# Altium project PCB_Project.PrjPcb
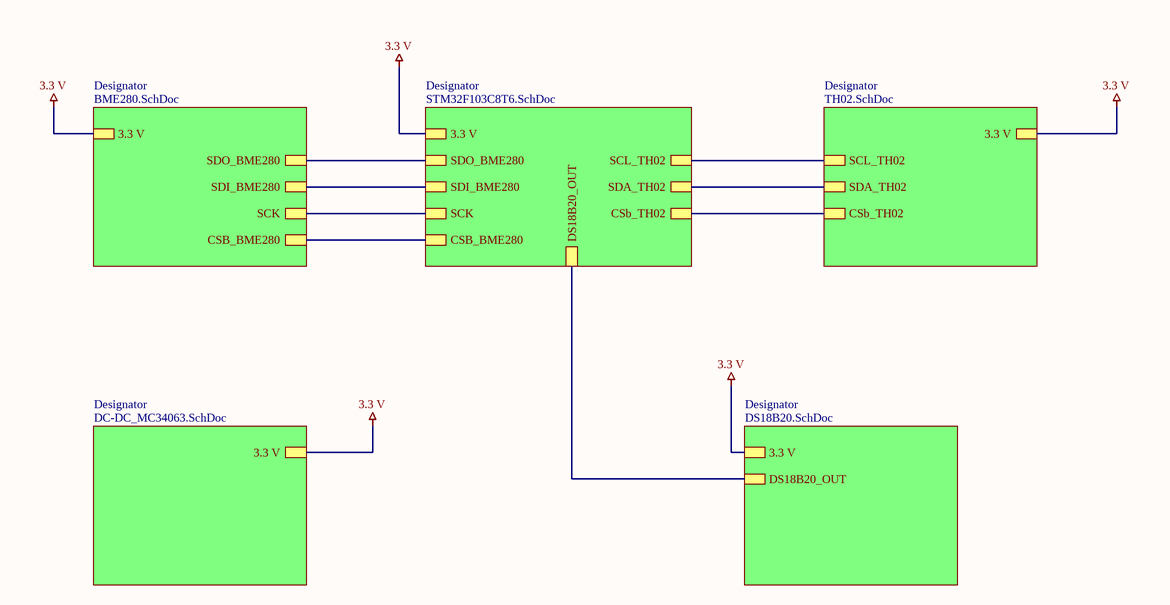
[diagram p0: MainSheet.SchDoc]
6 sheets, 39 parts. Net scope: hierarchical (ports join the sheet entries above them; power ports are global).
Board file: HackatonCircuit.PcbDoc
Sheets:
  MainSheet.SchDoc
    Designator = DC-DC_MC34063.SchDoc
    Designator = STM32F103C8T6.SchDoc
    Designator = DS18B20.SchDoc
    Designator = BME280.SchDoc
    Designator = TH02.SchDoc

## Sheet MainSheet.SchDoc
size A4; SheetNumber: 1; SheetTotal: 6

### Sub-sheets
Designator = DC-DC_MC34063.SchDoc: 3.3 V
Designator = STM32F103C8T6.SchDoc: 3.3 V, SDO_BME280, SDI_BME280, SCK, CSB_BME280, SCL_TH02, SDA_TH02, CSb_TH02, DS18B20_OUT
Designator = DS18B20.SchDoc: 3.3 V, DS18B20_OUT
Designator = BME280.SchDoc: 3.3 V, SDO_BME280, SDI_BME280, SCK, CSB_BME280
Designator = TH02.SchDoc: 3.3 V, SCL_TH02, SDA_TH02, CSb_TH02

### Nets
3.3 V: sheet Designator/3.3 V, sheet Designator/3.3 V, sheet Designator/3.3 V, sheet Designator/3.3 V, sheet Designator/3.3 V
NetIC1_2: sheet Designator/DS18B20_OUT, sheet Designator/DS18B20_OUT
NetIC2_3: sheet Designator/SCL_TH02, sheet Designator/SCL_TH02
NetIC2_4: sheet Designator/SDA_TH02, sheet Designator/SDA_TH02
NetIC2_15: sheet Designator/CSb_TH02, sheet Designator/CSb_TH02
NetIC3_2: sheet Designator/CSB_BME280, sheet Designator/CSB_BME280
NetIC3_3: sheet Designator/SDI_BME280, sheet Designator/SDI_BME280
NetIC3_4: sheet Designator/SCK, sheet Designator/SCK
NetIC3_5: sheet Designator/SDO_BME280, sheet Designator/SDO_BME280

## Sheet DC-DC_MC34063.SchDoc
size A4; SheetNumber: 2; SheetTotal: 6
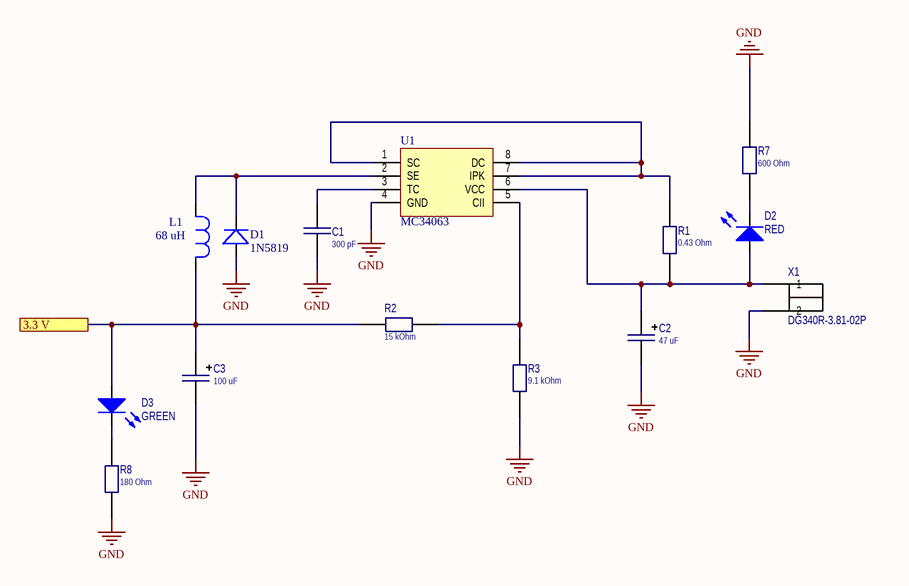
[diagram p1: DC-DC_MC34063.SchDoc]

### Parts
C1  300 pF  [C_0805]
C2  47 uF  [Cap 0810 F]
C3  100 uF  [Cap 0810 F]
D1  1N5819  [DO-41]
D2  RED  [LED_1206]
D3  GREEN  [LED_1206]
L1  68 uH  [L_1210]
R1  0.43 Ohm  [R_0805]
R2  15 kOhm  [R_0805]
R3  9.1 kOhm  [R_0805]
R7  600 Ohm  [R_0805]
R8  180 Ohm  [R_0805]
U1  MC34063  [SO-8]
X1  DG340R-3.81-02P  [340-021-12]

### Ports
3.3 V (see MainSheet[2C], BME280[2B], DS18B20[2C], STM32F103C8T6[1C], TH02[1B])

### Nets
3.3 V: C3.2 D3.1(A) L1.2 R2.1 ; port 3.3 V
GND: C1.1 C2.1 C3.1 D1.1(A) R3.1 R7.2 R8.1 U1.4(GND) X1.2
NetC1_2: C1.2 U1.3(TC)
NetC2_2: C2.2 D2.1(A) R1.1 U1.6(VCC) X1.1
NetD1_2: D1.2(K) L1.1 U1.2(SE)
NetD2_2: D2.2(K) R7.1
NetD3_2: D3.2(K) R8.2
NetR1_2: R1.2 U1.1(SC) U1.7(IPK) U1.8(DC)
NetR2_2: R2.2 R3.2 U1.5(CII)

### Library data of the parts
C1 = C0805: Capacitor; Value: 300 pF
C2 C3 = CAP0810Alu: Capacitor
  C2: Value: 47 uF
  C3: Value: 100 uF
D2 D3 = LED_SMT_1206: Typical INFRARED GaAs LED; Value: *; Color: *
L1 = L1210: Inductor; Part Number: NLCV32T-680K-EF
R1-R3 R7 R8 = R0805: Resistor
  R1: Value: 0.43 Ohm
  R2: Value: 15 kOhm
  R3: Value: 9.1 kOhm
  R7: Value: 600 Ohm
  R8: Value: 180 Ohm
X1 = DG340R-3.81-02P: Connectors; Type: DG340R-3.81-02P

## Sheet STM32F103C8T6.SchDoc
size A4; SheetNumber: 6; SheetTotal: 6
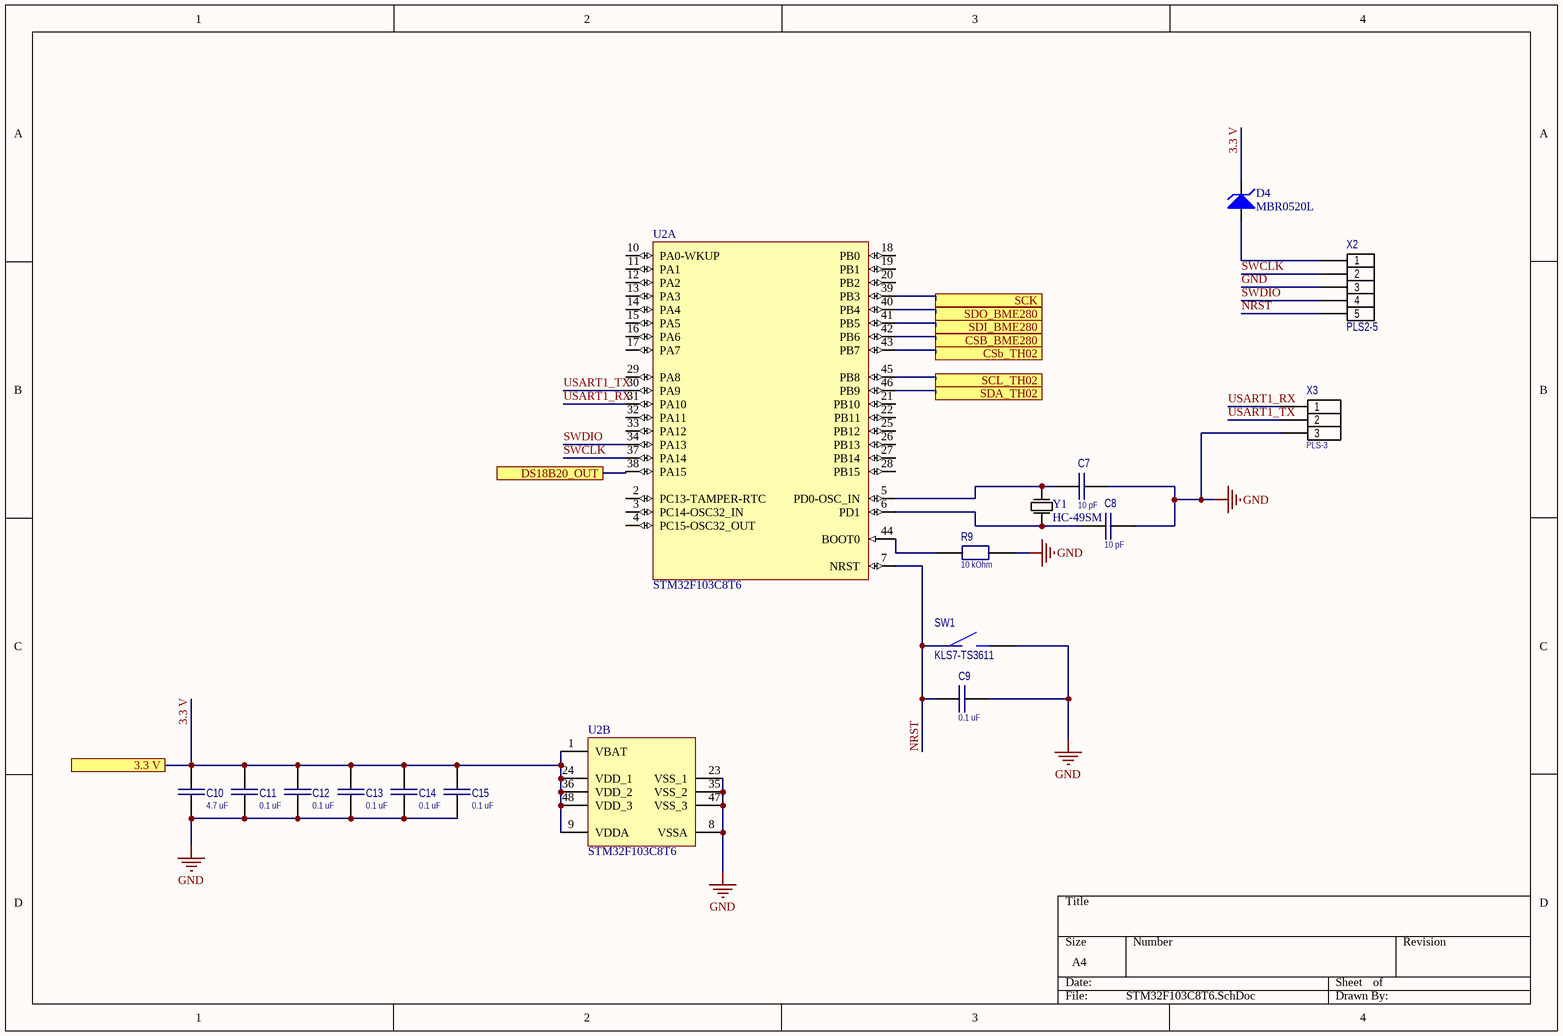
[diagram p2: STM32F103C8T6.SchDoc]

### Parts
C7  10 pF  [C_0805]
C8  10 pF  [C_0805]
C9  0.1 uF  [C_0805]
C10  4.7 uF  [C_0805]
C11  0.1 uF  [C_0805]
C12  0.1 uF  [C_0805]
C13  0.1 uF  [C_0805]
C14  0.1 uF  [C_0805]
C15  0.1 uF  [C_0805]
D4  MBR0520L  [SOD-123]
R9  10 kOhm  [R_0805]
SW1  KLS7-TS3611  [KLS7-TS3611]
U2  STM32F103C8T6  [LQFP48_N]  (parts A,B of 2)
X2  PLS2-5  [PLS-5-2]
X3  PLS-3  [PLS-3-3D]
Y1  HC-49SM  [HC-49SM]

### Ports
3.3 V (see MainSheet[2A], BME280[2B], DC-DC_MC34063[1B], DS18B20[2C], TH02[1B]), CSB_BME280 (see MainSheet[2B], BME280[3B]), CSb_TH02 (see MainSheet[3B], TH02[1C]), DS18B20_OUT (see MainSheet[3B], DS18B20[1B]), SCK (see MainSheet[2B], BME280[3B]), SCL_TH02 (see MainSheet[3B], TH02[1B]), SDA_TH02 (see MainSheet[3B], TH02[1B]), SDI_BME280 (see MainSheet[2B], BME280[3B]), SDO_BME280 (see MainSheet[2B], BME280[1B])

### Nets
3.3 V: C10.2 C11.2 C12.2 C13.2 C14.2 C15.2 D4.2(K) U2.1(VBAT) U2.9(VDDA) U2.24(VDD_1) U2.36(VDD_2) U2.48(VDD_3) ; port 3.3 V
GND: C7.1 C8.1 C9.1 C10.1 C11.1 C12.1 C13.1 C14.1 C15.1 R9.1 SW1.2 U2.8(VSSA) U2.23(VSS_1) U2.35(VSS_2) U2.47(VSS_3) X2.3 X3.3
NRST: C9.2 SW1.1 U2.7(NRST) X2.5
SWCLK: U2.37(PA14) X2.2
SWDIO: U2.34(PA13) X2.4
USART1_RX: U2.31(PA10) X3.1
USART1_TX: U2.30(PA9) X3.2
NetC7_2: C7.2 U2.5(PD0-OSC_IN) Y1.2(OSC2)
NetC8_2: C8.2 U2.6(PD1) Y1.1(OSC1)
NetD4_1: D4.1(A) X2.1
NetIC1_2: U2.38(PA15) ; port DS18B20_OUT
NetIC2_3: U2.45(PB8) ; port SCL_TH02
NetIC2_4: U2.46(PB9) ; port SDA_TH02
NetIC2_15: U2.43(PB7) ; port CSb_TH02
NetIC3_2: U2.42(PB6) ; port CSB_BME280
NetIC3_3: U2.41(PB5) ; port SDI_BME280
NetIC3_4: U2.39(PB3) ; port SCK
NetIC3_5: U2.40(PB4) ; port SDO_BME280
NetR9_2: R9.2 U2.44(BOOT0)

Not connected (* = marked no-connect by the designer): U2 2(PC13-TAMPER-RTC) 3(PC14-OSC32_IN) 4(PC15-OSC32_OUT) 10(PA0-WKUP) 11(PA1) 12(PA2) 13(PA3) 14(PA4) 15(PA5) 16(PA6) 17(PA7) 18(PB0) 19(PB1) 20(PB2) 21(PB10) 22(PB11) 25(PB12) 26(PB13) 27(PB14) 28(PB15) 29(PA8) 32(PA11) 33(PA12)

### Library data of the parts
C7-C15 = C0805: Capacitor
  C7 C8: Value: 10 pF
  C9 C11-C15: Value: 0.1 uF
  C10: Value: 4.7 uF
D4 = DZ_SOD123: Surface Mount Zener Diode; Published: 8-Jun-2000; LatestRevisionDate: 17-Jul-2002; LatestRevisionNote: Re-released for DXP Platform.; DatasheetDocument: REV. L-2; PackageReference: SOD-123; Publisher: Altium Limited; ComponentLink1Description: Manufacturer Link; ComponentLink1URL: http://www.vishay.com/
R9 = R0805: Resistor; Value: 10 kOhm
SW1 = button
X2 = PLS2-5: Header, 5-Pin; LatestRevisionDate: 17-Jul-2002; LatestRevisionNote: Re-released for DXP Platform.; Publisher: Altium Limited
X3 = PLS-3: Header, 3-Pin; LatestRevisionDate: 17-Jul-2002; LatestRevisionNote: Re-released for DXP Platform.; Publisher: Altium Limited
U2 = STM32F103C8T6: DatasheetVersion: rev13.0, Apr-2011; PackageVersion: rev13, Apr-2011; PackageReference: LQFP48; PackageDescription: 48-Pin Low-Profile Quad Flat Pack, 7 x 7 mm Body, 0.5 mm Pitch (LQFP48); ComponentLink1Description: Manufacturer URL; ComponentLink1URL: http://www.st.com/; ComponentLink2Description: STM32F103 Datasheet; ComponentLink2URL: http://www.st.com/internet/com/TECHNICAL_RESOURCES/TECHNICAL_LITERATURE/DATASHEET/CD00161566.pdf; ComponentLink3Description: STM32 Family Web Page; ComponentLink3URL: www.st.com/stm32

## Sheet DS18B20.SchDoc
size A4; SheetNumber: 3; SheetTotal: 6
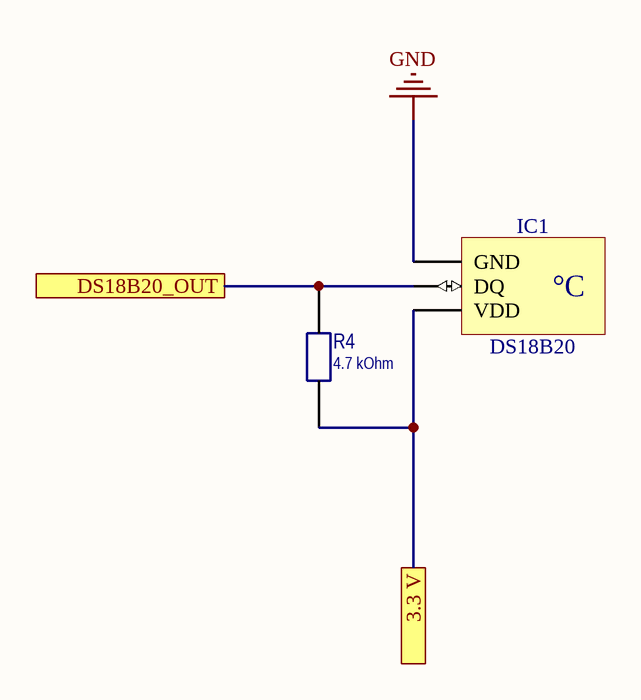
[diagram p3: DS18B20.SchDoc]

### Parts
IC1  DS18B20  [DS18B20]
R4  4.7 kOhm  [R_0805]

### Ports
3.3 V (see MainSheet[3C], BME280[2B], DC-DC_MC34063[1B], STM32F103C8T6[1C], TH02[1B]), DS18B20_OUT (see MainSheet[3C], STM32F103C8T6[2B])

### Nets
3.3 V: IC1.3(VDD) R4.1 ; port 3.3 V
GND: IC1.1(GND)
NetIC1_2: IC1.2(DQ) R4.2 ; port DS18B20_OUT

### Notes on the sheet
- (in symbol DS18B20+) °C

### Library data of the parts
IC1 = DS18B20+: Programmable Resolution 1-Wire Digital Thermometer
R4 = R0805: Resistor; Value: 4.7 kOhm

## Sheet BME280.SchDoc
size A4; SheetNumber: 5; SheetTotal: 6
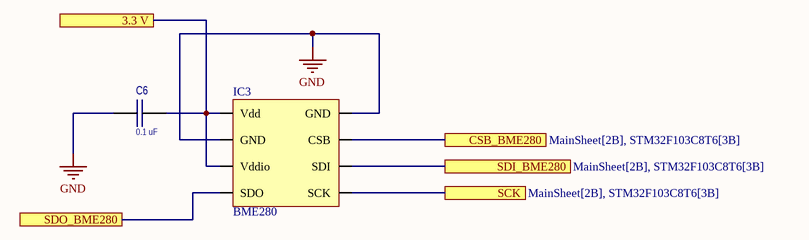
[diagram p4: BME280.SchDoc]

### Parts
C6  0.1 uF  [C_0805]
IC3  BME280  [BME280]

### Ports
3.3 V (see MainSheet[1A], DC-DC_MC34063[1B], DS18B20[2C], STM32F103C8T6[1C], TH02[1B]), CSB_BME280 (see MainSheet[2B], STM32F103C8T6[3B]), SCK (see MainSheet[2B], STM32F103C8T6[3B]), SDI_BME280 (see MainSheet[2B], STM32F103C8T6[3B]), SDO_BME280 (see MainSheet[2B], STM32F103C8T6[3B])

### Nets
3.3 V: C6.1 IC3.6(Vddio) IC3.8(Vdd) ; port 3.3 V
GND: C6.2 IC3.1(GND) IC3.7(GND)
NetIC3_2: IC3.2(CSB) ; port CSB_BME280
NetIC3_3: IC3.3(SDI) ; port SDI_BME280
NetIC3_4: IC3.4(SCK) ; port SCK
NetIC3_5: IC3.5(SDO) ; port SDO_BME280

### Library data of the parts
C6 = C0805: Capacitor; Value: 0.1 uF

## Sheet TH02.SchDoc
size A4; SheetNumber: 4; SheetTotal: 6
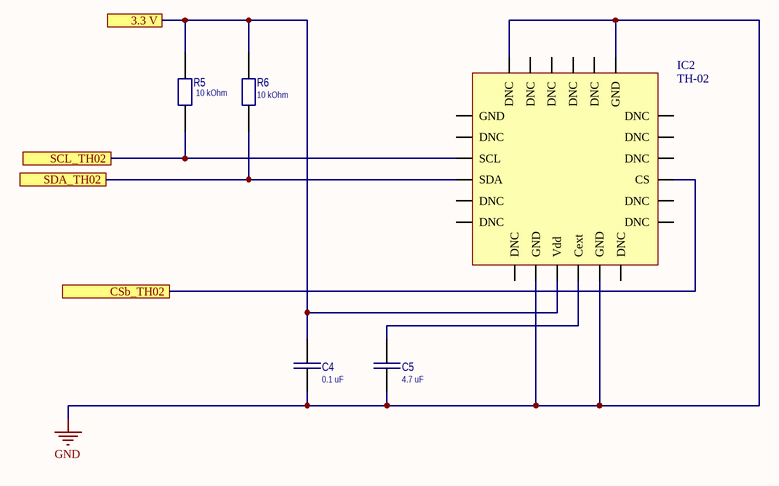
[diagram p5: TH02.SchDoc]

### Parts
C4  0.1 uF  [C_0805]
C5  4.7 uF  [C_0805]
IC2  TH-02  [TH-02]
R5  10 kOhm  [R_0805]
R6  10 kOhm  [R_0805]

### Ports
3.3 V (see MainSheet[4A], BME280[2B], DC-DC_MC34063[1B], DS18B20[2C], STM32F103C8T6[1C]), CSb_TH02 (see MainSheet[3B], STM32F103C8T6[3B]), SCL_TH02 (see MainSheet[3B], STM32F103C8T6[3B]), SDA_TH02 (see MainSheet[3B], STM32F103C8T6[3B])

### Nets
3.3 V: C4.2 IC2.9(Vdd) R5.2 R6.2 ; port 3.3 V
GND: C4.1 C5.1 IC2.8(GND) IC2.11(GND) IC2.19(GND) IC2.24(DNC)
NetC5_2: C5.2 IC2.10(Cext)
NetIC2_3: IC2.3(SCL) R5.1 ; port SCL_TH02
NetIC2_4: IC2.4(SDA) R6.1 ; port SDA_TH02
NetIC2_15: IC2.15(CS) ; port CSb_TH02

Not connected (* = marked no-connect by the designer): IC2 1(GND) 2(DNC) 5(DNC) 6(DNC) 7(DNC) 12(DNC) 13(DNC) 14(DNC) 16(DNC) 17(DNC) 18(DNC) 20(DNC) 21(DNC) 22(DNC) 23(DNC)

### Library data of the parts
C4 C5 = C0805: Capacitor
  C4: Value: 0.1 uF
  C5: Value: 4.7 uF
IC2 = TH_02: Temperature and humidity sensor
R5 R6 = R0805: Resistor; Value: 10 kOhm

## Nets that join several sheets
3.3 V: DC-DC_MC34063 (C3.2 D3.1 L1.2 R2.1), STM32F103C8T6 (12 pins), DS18B20 (IC1.3 R4.1), BME280 (C6.1 IC3.6 IC3.8), TH02 (C4.2 IC2.9 R5.2 R6.2)
GND: DC-DC_MC34063 (9 pins), STM32F103C8T6 (17 pins), DS18B20 (IC1.1), BME280 (C6.2 IC3.1 IC3.7), TH02 (6 pins)
NetIC1_2: STM32F103C8T6 (U2.38), DS18B20 (IC1.2 R4.2)
NetIC2_3: STM32F103C8T6 (U2.45), TH02 (IC2.3 R5.1)
NetIC2_4: STM32F103C8T6 (U2.46), TH02 (IC2.4 R6.1)
NetIC2_15: STM32F103C8T6 (U2.43), TH02 (IC2.15)
NetIC3_2: STM32F103C8T6 (U2.42), BME280 (IC3.2)
NetIC3_3: STM32F103C8T6 (U2.41), BME280 (IC3.3)
NetIC3_4: STM32F103C8T6 (U2.39), BME280 (IC3.4)
NetIC3_5: STM32F103C8T6 (U2.40), BME280 (IC3.5)